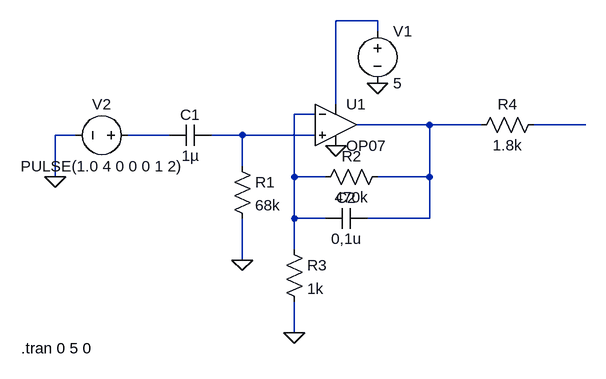
[diagram p0: schematic Op-Amp2.asc]
Op-Amp2.asc, the LTspice schematic file:
Version 4
SHEET 1 880 680
WIRE 304 0 240 0
WIRE 304 16 304 0
WIRE 240 128 240 0
WIRE 208 144 176 144
WIRE 384 160 272 160
WIRE 464 160 384 160
WIRE 624 160 544 160
WIRE -160 176 -192 176
WIRE -16 176 -80 176
WIRE 96 176 48 176
WIRE 208 176 96 176
WIRE 96 224 96 176
WIRE -192 240 -192 176
WIRE 176 240 176 144
WIRE 224 240 176 240
WIRE 384 240 384 160
WIRE 384 240 304 240
WIRE 176 304 176 240
WIRE 224 304 176 304
WIRE 384 304 384 240
WIRE 384 304 288 304
WIRE 176 352 176 304
WIRE 96 368 96 304
WIRE 176 480 176 432
FLAG 96 368 0
FLAG 176 480 0
FLAG 240 192 0
FLAG 304 96 0
FLAG -192 240 0
SYMBOL Opamps\\OP07 240 96 R0
SYMATTR InstName U1
SYMBOL res 80 208 R0
SYMATTR InstName R1
SYMATTR Value 68k
SYMBOL res 320 224 R90
WINDOW 0 0 56 VBottom 2
WINDOW 3 32 56 VTop 2
SYMATTR InstName R2
SYMATTR Value 470k
SYMBOL cap 288 288 R90
WINDOW 0 0 32 VBottom 2
WINDOW 3 32 32 VTop 2
SYMATTR InstName C2
SYMATTR Value 0,1u
SYMBOL res 160 336 R0
SYMATTR InstName R3
SYMATTR Value 1k
SYMBOL voltage 304 0 R0
SYMATTR InstName V1
SYMATTR Value 5
SYMBOL voltage -64 176 R90
WINDOW 0 -32 56 VBottom 2
WINDOW 3 32 56 VTop 2
WINDOW 123 0 0 Left 0
WINDOW 39 0 0 Left 0
SYMATTR InstName V2
SYMATTR Value PULSE(1.0 4 0 0 0 1 2)
SYMBOL res 560 144 R90
WINDOW 0 0 56 VBottom 2
WINDOW 3 32 56 VTop 2
SYMATTR InstName R4
SYMATTR Value 1.8k
SYMBOL cap 48 160 R90
WINDOW 0 0 32 VBottom 2
WINDOW 3 32 32 VTop 2
SYMATTR InstName C1
SYMATTR Value 1µ
TEXT -244 504 Left 2 !.tran 0 5 0

The netlist it stands for:
* Op-Amp2.asc
XU1 N006 N002 N001 0 N003 LT1001  ; OP07, pins In+ In- V+ V- OUT
R1 N006 0 68k
R2 N003 N002 470k
C2 N003 N002 0,1u
R3 N002 0 1k
V1 N001 0 5
V2 N005 0 PULSE(1.0 4 0 0 0 1 2)
R4 N004 N003 1.8k
C1 N006 N005 1µ
.tran 0 5 0
.lib LTC.lib
.backanno
.end